# EAGLE design dLatch (EAGLE 9.6.2)
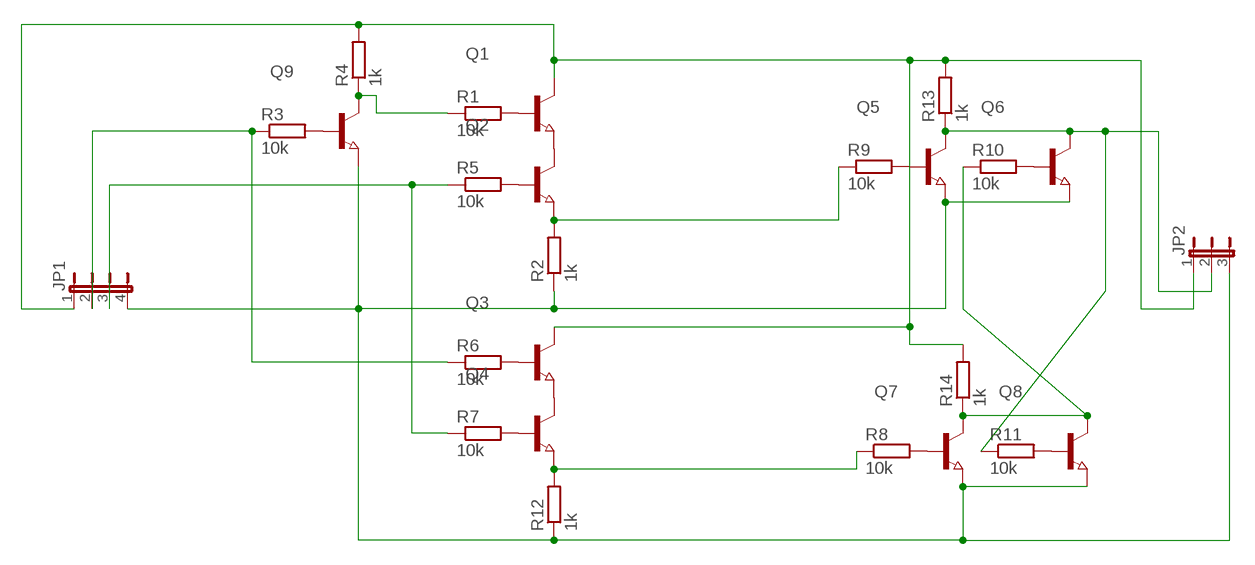
[diagram p0: schematic, sheet 1]

## Parts
JP1  JP4E  [JP4]
JP2  JP2W  [JP2W]
Q1  NPN-TRANSISTOR_SOT23  [SOT23]
Q2  NPN-TRANSISTOR_SOT23  [SOT23]
Q3  NPN-TRANSISTOR_SOT23  [SOT23]
Q4  NPN-TRANSISTOR_SOT23  [SOT23]
Q5  NPN-TRANSISTOR_SOT23  [SOT23]
Q6  NPN-TRANSISTOR_SOT23  [SOT23]
Q7  NPN-TRANSISTOR_SOT23  [SOT23]
Q8  NPN-TRANSISTOR_SOT23  [SOT23]
Q9  NPN-TRANSISTOR_SOT23  [SOT23]
R1  10k  R-EU_R1206  [R1206]
R2  1k  R-EU_R1206  [R1206]
R3  10k  R-EU_R1206  [R1206]
R4  1k  R-EU_R1206  [R1206]
R5  10k  R-EU_R1206  [R1206]
R6  10k  R-EU_R1206  [R1206]
R7  10k  R-EU_R1206  [R1206]
R8  10k  R-EU_R1206  [R1206]
R9  10k  R-EU_R1206  [R1206]
R10  10k  R-EU_R1206  [R1206]
R11  10k  R-EU_R1206  [R1206]
R12  1k  R-EU_R1206  [R1206]
R13  1k  R-EU_R1206  [R1206]
R14  1k  R-EU_R1206  [R1206]

## Nets
N$1: Q1.2(E) Q2.3(C)
N$2: Q3.2(E) Q4.3(C)
N$3: Q2.2(E) R2.2 R9.1
N$4: Q1.1(B) R1.2
N$5: Q9.1(B) R3.2
N$6: Q9.3(C) R1.1 R4.1
N$7: Q2.1(B) R5.2
N$8: Q3.1(B) R6.2
N$9: Q4.1(B) R7.2
N$10: Q7.1(B) R8.2
N$11: Q5.1(B) R9.2
N$12: Q6.1(B) R10.2
N$13: Q8.1(B) R11.2
N$14: Q4.2(E) R8.1 R12.2
N$15: JP2.2 Q5.3(C) Q6.3(C) R11.1 R13.1
N$19: JP1.4 JP2.3 Q5.2(E) Q6.2(E) Q7.2(E) Q8.2(E) Q9.2(E) R2.1 R12.1
N$20: JP1.1 JP2.1 Q1.3(C) Q3.3(C) R4.2 R13.2 R14.2
N$21: Q7.3(C) Q8.3(C) R10.1 R14.1
N$23: JP1.2 R3.1 R6.1
N$24: JP1.3 R5.1 R7.1

## Library data of the parts
JP1 = jumper:JP4E: JUMPER
JP2 = jumper:JP2W: JUMPER
Q1-Q9 = semicon-smd-ipc:NPN-TRANSISTOR_: NPN TRANSISTOR
R1-R14 = rcl:R-EU_: RESISTOR, European symbol; SPICEPREFIX: R

## Net classes
0 default: width 1.27 mm, clearance 0.205 mm

## Board
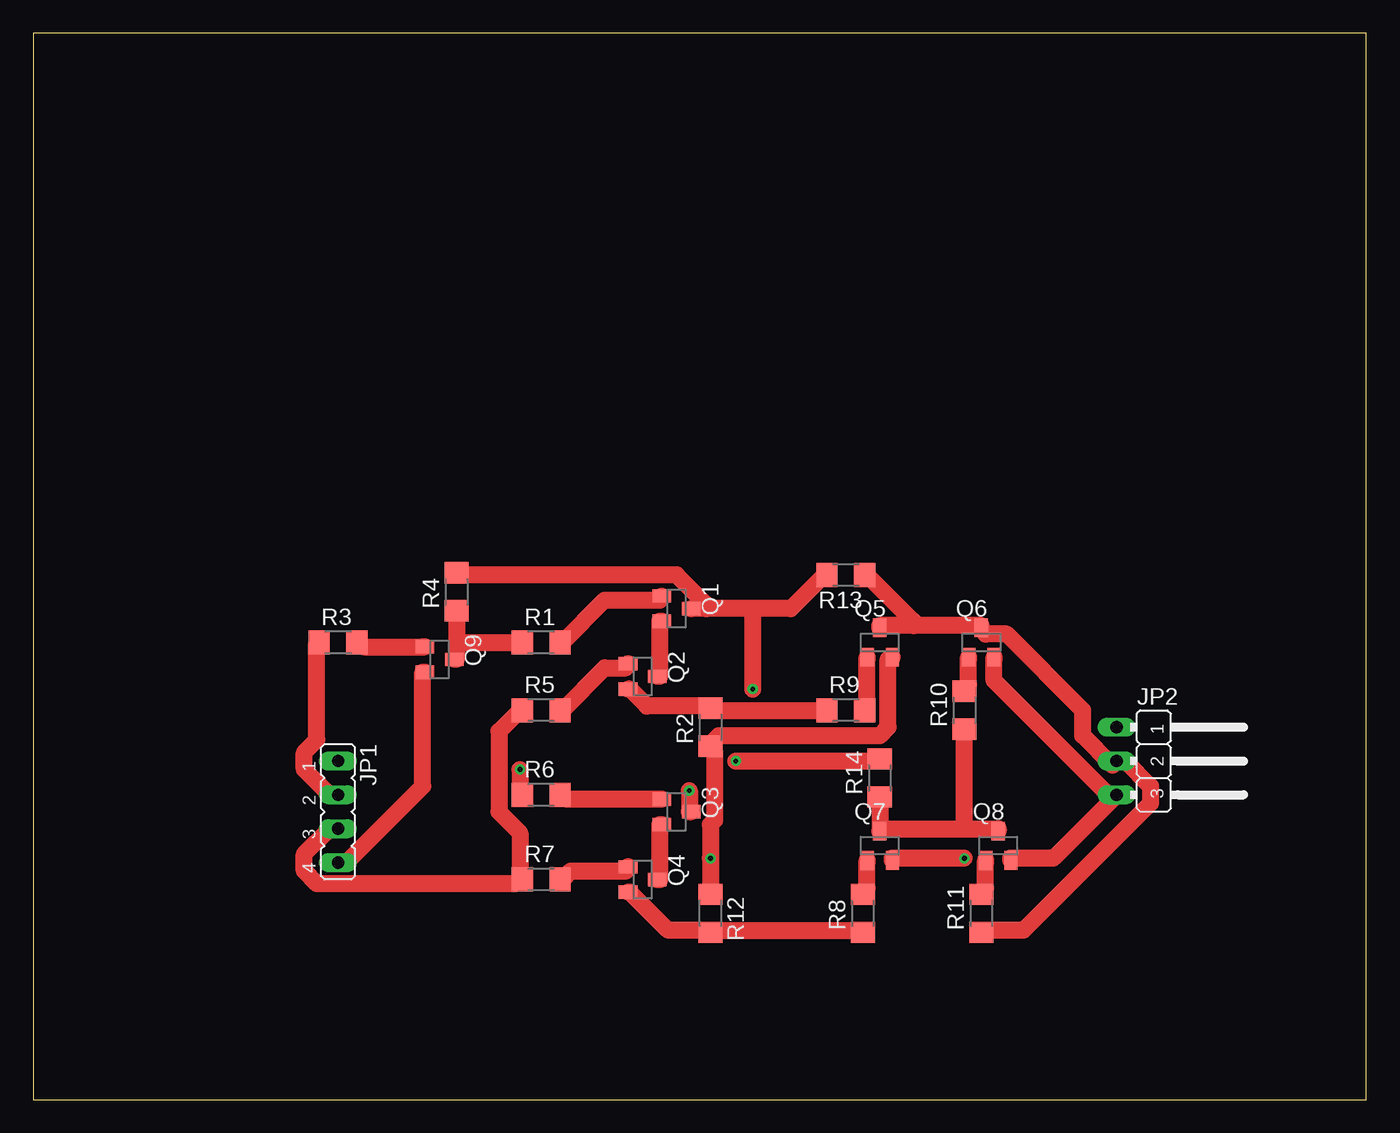
[diagram p1: board, top side]
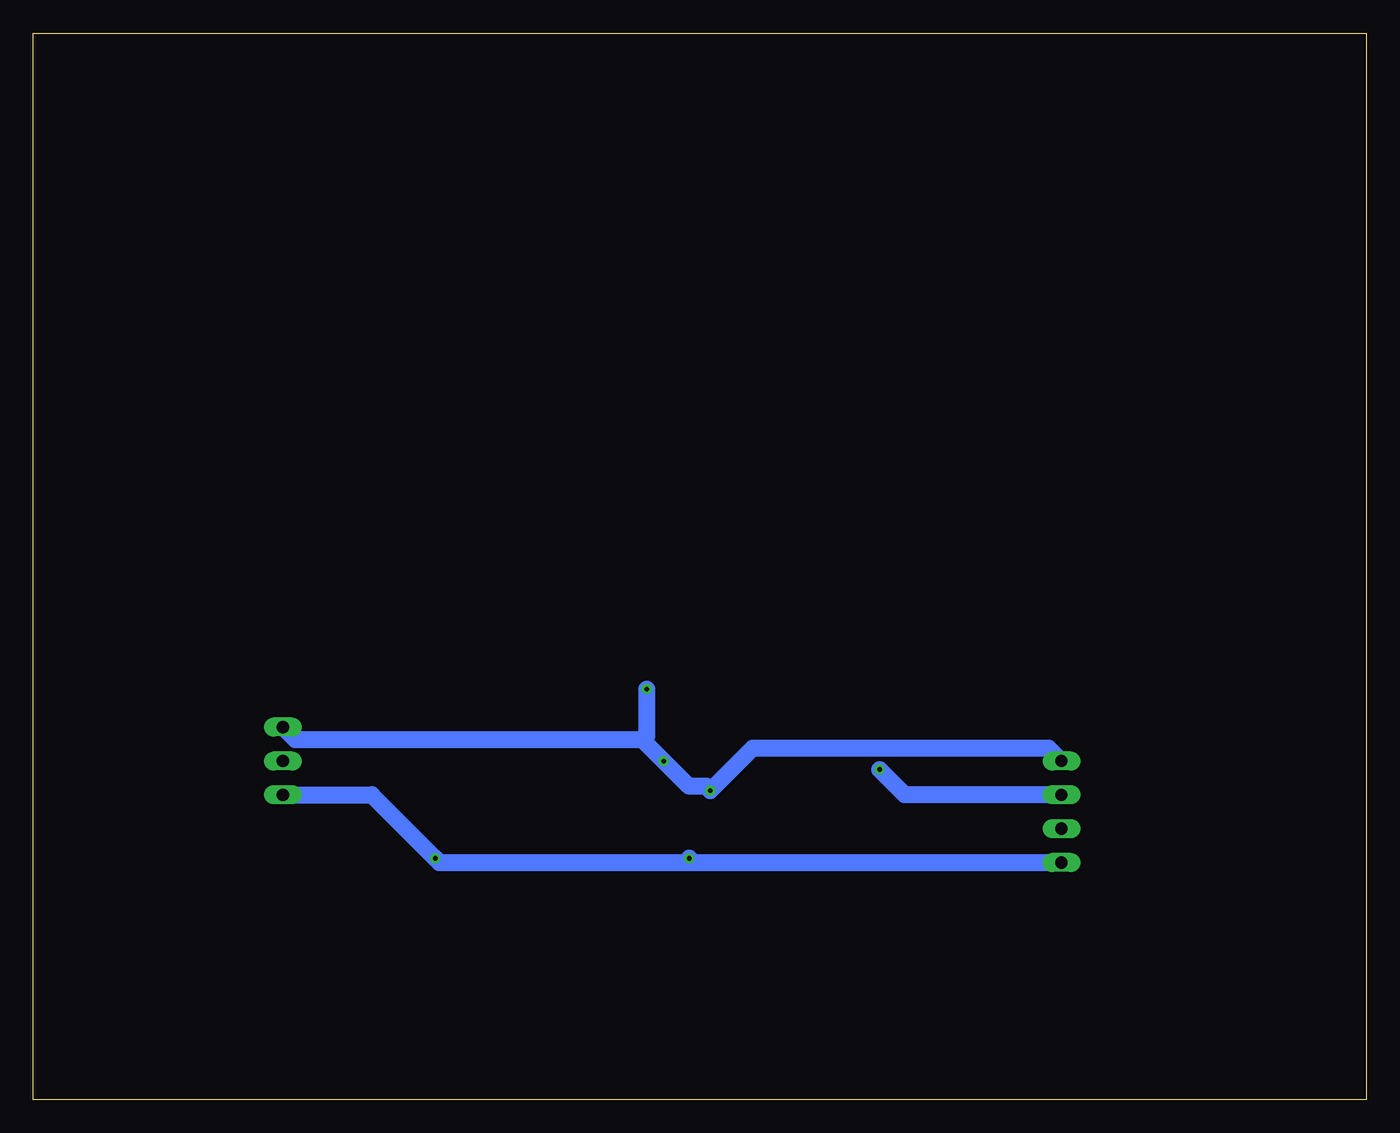
[diagram p2: board, bottom side, seen from below]

Size 100 x 80 mm. Coordinates in mm from the lower left corner, seen from the top.
Outline: 0,0 100,0 100,80 0,80 0,0
Copper layers (1*16): Top 0.035mm / dielectric 1.5mm / Bottom 0.035mm
Design rules "default": minimum track width 6mil, minimum drill 0.35mm, track to track 6mil, track to pad 6mil, pad to pad 6mil, via to via 6mil, smd to smd 6mil, copper to edge 40mil, drill to drill 6mil, minimum pad ring 10mil, minimum via ring 8mil, stop-mask expansion 4mil, vias tented up to drill 0mil, thermal gap 10mil

### Footprints (pad centres in the part's own frame; a part is rotated, then mirrored left to right if it is on the bottom)
JP4 = drill 0.914 long: 1 -3.81,0; 2 -1.27,0; 3 1.27,0; 4 3.81,0
JP2W = drill 0.914 long: 1 -2.54,-1.27; 2 0,-1.27; 3 2.54,-1.27
SOT23 = smd 1 x 1.4: 1 -0.95,-1.1; 2 0.95,-1.1; 3 0,1.1
R1206 = smd 1.6 x 1.803: 1 -1.422,0; 2 1.422,0

### Placement (x,y rotation side)
JP1  22.86,21.59 270 top
JP2  82.55,25.4 270 top
Q1  48.26,36.83 270 top
Q2  45.72,31.75 270 top
Q3  48.26,21.59 270 top
Q4  45.72,16.51 270 top
Q5  63.5,34.29 0 top
Q6  71.12,34.29 0 top
Q7  63.5,19.05 0 top
Q8  72.39,19.05 0 top
Q9  30.48,33.02 270 top
R1  38.1,34.29 0 top
R2  50.8,27.94 90 top
R3  22.86,34.29 0 top
R4  31.75,38.1 90 top
R5  38.1,29.21 0 top
R6  38.1,22.86 0 top
R7  38.1,16.51 0 top
R8  62.23,13.97 90 top
R9  60.96,29.21 0 top
R10  69.85,29.21 90 top
R11  71.12,13.97 90 top
R12  50.8,13.97 270 top
R13  60.96,39.37 180 top
R14  63.5,24.13 90 top

### Tracks (layer width: path | path; a pad name or v marks a point on that pad's centre or on a via)
N$1
  Top 1.27: Q2.3 46.99,31.75 46.99,35.88 Q1.2
N$2
  Top 1.27: Q4.3 46.99,16.51 46.99,20.64 Q3.2
N$3
  Top 1.27: Q2.2 44.77,30.8 46.04,29.53 50.8,29.53 R2.2 51.12,29.21 R9.1
N$4
  Top 1.27: Q1.1 46.99,37.47 42.86,37.47 39.69,34.29 R1.2
N$5
  Top 1.27: Q9.1 29.21,33.97 24.77,33.97 24.45,34.29 R3.2
N$6
  Top 1.27: R4.1 31.75,34.29 | 31.75,34.29 31.75,33.02 Q9.3 | 31.75,34.29 R1.1
N$7
  Top 1.27: Q2.1 44.45,32.38 42.86,32.38 39.69,29.21 R5.2
N$8
  Top 1.27: Q3.1 46.99,22.54 40.01,22.54 39.69,22.86 R6.2
N$9
  Top 1.27: Q4.1 44.45,17.14 40.32,17.14 39.69,16.51 R7.2
N$10
  Top 1.27: Q7.1 62.55,17.78 62.55,15.88 62.23,15.56 R8.2
N$11
  Top 1.27: Q5.1 62.55,33.02 62.55,29.21 R9.2
N$12
  Top 1.27: Q6.1 70.17,33.02 70.17,31.11 69.85,30.8 R10.2
N$13
  Top 1.27: Q8.1 71.44,17.78 71.44,15.88 71.12,15.56 R11.2
N$14
  Top 1.27: Q4.2 44.77,15.56 47.62,12.7 50.8,12.7 R12.2 51.12,12.7 62.23,12.7 R8.1
N$15
  Top 1.27: 66.04,35.56 71.12,35.56 Q6.3 71.44,34.92 73.03,34.92 78.74,29.21 78.74,27.3 80.96,25.08 JP2.2 81.92,25.4 83.82,23.5 83.82,22.23 74.3,12.7 71.12,12.7 R11.1 | 66.04,35.56 63.5,35.56 Q5.3 | R13.1 62.55,39.37 66.04,35.88 66.04,35.56
N$19  (via drill 0.35)
  Top 1.27: Q5.2 64.14,33.02 64.14,27.94 63.5,27.3 51.44,27.3 50.8,26.67 R2.1 51.12,26.04 51.12,20.95 50.8,20.64 v50.8,18.1 R12.1 | JP1.4 23.5,17.78 29.21,23.5 29.21,32.07 Q9.2 | v69.85,18.1 64.45,18.1 Q7.2 | Q8.2 73.34,18.1 76.52,18.1 JP2.3 80.64,22.86 72.07,31.43 72.07,33.02 Q6.2
  Bottom 1.27: JP2.3 74.61,22.86 v69.85,18.1 69.53,17.78 50.8,17.78 | 50.8,17.78 JP1.4 | v50.8,18.1 50.8,17.78
N$20  (via drill 0.35)
  Top 1.27: 53.98,36.83 56.83,36.83 59.37,39.37 R13.2 | 53.98,36.83 50.48,36.83 | 50.48,36.83 Q1.3 | R4.2 31.75,39.37 48.26,39.37 50.48,37.15 50.48,36.83 | v49.21,23.18 49.21,21.59 Q3.3 | v52.7,25.4 63.5,25.4 R14.2 | v53.98,30.8 53.98,36.83
  Bottom 1.27: JP1.1 23.81,26.35 46.04,26.35 v49.21,23.18 49.53,23.5 50.8,23.5 v52.7,25.4 54.29,26.99 | JP2.1 80.33,26.99 54.29,26.99 | v53.98,30.8 53.98,27.3 54.29,26.99
N$21
  Top 1.27: R14.1 Q7.3 63.82,20.32 69.85,20.32 | 69.85,20.32 72.39,20.32 Q8.3 | 69.85,20.32 R10.1
N$23  (via drill 0.35)
  Top 1.27: JP1.2 22.23,22.86 20.32,24.77 20.32,26.04 21.27,26.99 21.27,34.29 R3.1 | v36.51,24.77 36.51,22.86 R6.1
  Bottom 1.27: v36.51,24.77 34.61,22.86 JP1.2
N$24
  Top 1.27: R5.1 36.51,29.21 34.92,27.62 34.92,21.59 36.51,20 36.51,16.51 R7.1 36.2,16.19 21.27,16.19 20.32,17.14 20.32,18.41 22.23,20.32 JP1.3